# EAGLE design AeroQuad_v18 (EAGLE 5.10)
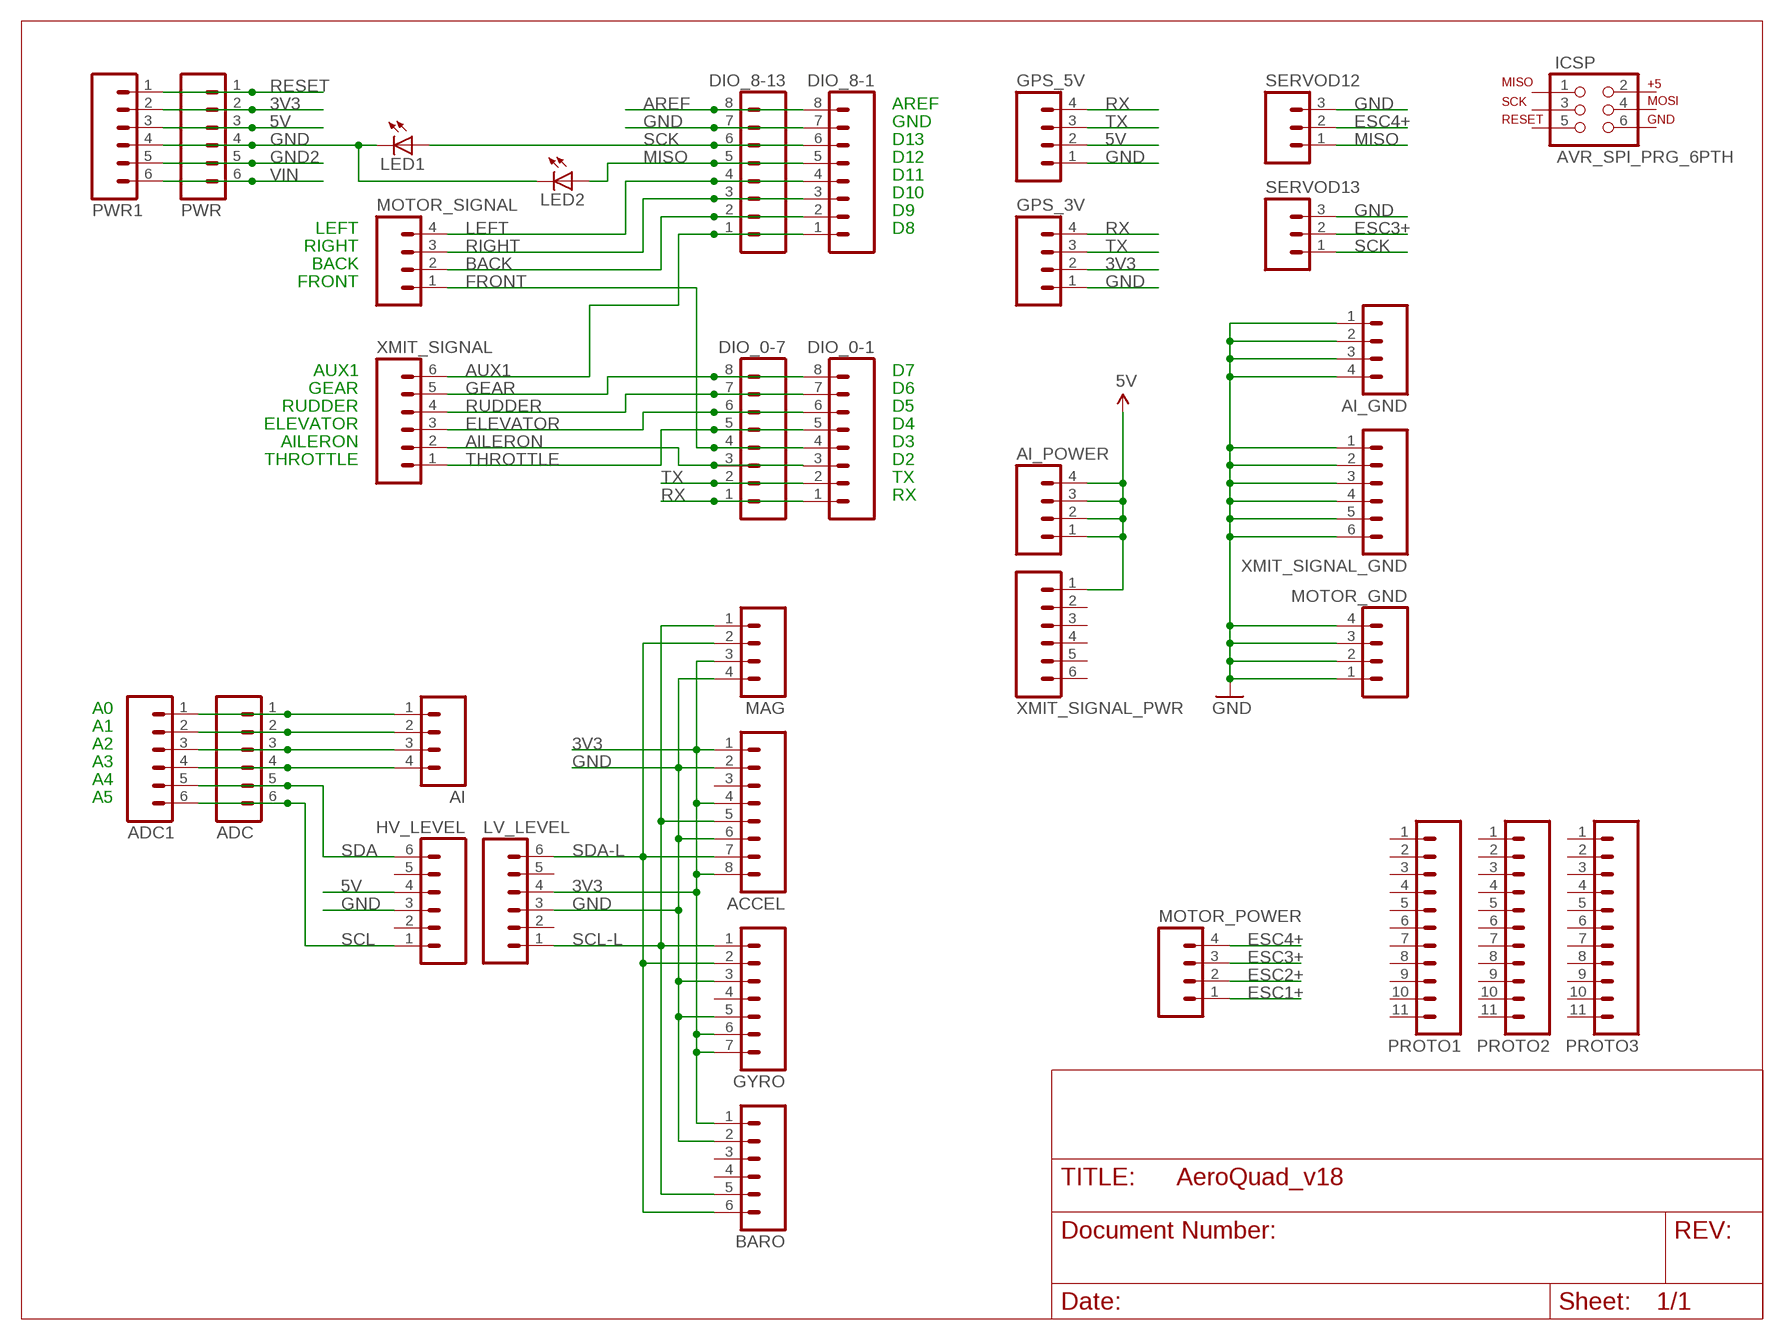
[diagram p0: schematic, sheet 1]

## Parts
ACCEL  M08LOCK  [1X08_LOCK]
ADC  M06LOCK  [1X06_LOCK]
ADC1  M06LOCK  [1X06_LOCK]
AI  M04LOCK  [1X04_LOCK]
AI_GND  M04LOCK  [1X04_LOCK]
AI_POWER  M04LOCK  [1X04_LOCK]
BARO  M06LOCK  [1X06_LOCK]
DIO_0-1  M08LOCK  [1X08_LOCK]
DIO_0-7  M08LOCK  [1X08_LOCK]
DIO_8-1  M08LOCK  [1X08_LOCK]
DIO_8-13  M08LOCK  [1X08_LOCK]
GPS_3V  M04LOCK  [1X04_LOCK]
GPS_5V  M04LOCK  [1X04_LOCK]
GYRO  M07LOCK  [1X07_LOCK]
HV_LEVEL  M06LOCK  [1X06_LOCK]
ICSP  AVR_SPI_PRG_6PTH  [2X3]
LED1  LED5MM  [LED5MM]
LED2  LED5MM  [LED5MM]
LV_LEVEL  M06LOCK  [1X06_LOCK]
MAG  M04LOCK  [1X04_LOCK]
MOTOR_GND  M04LOCK  [1X04_LOCK]
MOTOR_POWER  M04LOCK  [1X04_LOCK]
MOTOR_SIGNAL  M04LOCK  [1X04_LOCK]
PROTO1  M11PTH  [1X11]
PROTO2  M11PTH  [1X11]
PROTO3  M11PTH  [1X11]
PWR  M06LOCK  [1X06_LOCK]
PWR1  M06LOCK  [1X06_LOCK]
SERVOD12  M03LOCK  [1X03_LOCK]
SERVOD13  M03LOCK  [1X03_LOCK]
XMIT_SIGNAL  M06LOCK  [1X06_LOCK]
XMIT_SIGNAL_GND  M06LOCK  [1X06_LOCK]
XMIT_SIGNAL_PWR  M06LOCK  [1X06_LOCK]

## Nets
3V3: ACCEL.1 ACCEL.4 ACCEL.8 BARO.1 GPS_3V.2 GYRO.6 GYRO.7 LV_LEVEL.4 MAG.3 PWR1.2 PWR.2
5V: AI_POWER.1 AI_POWER.2 AI_POWER.3 AI_POWER.4 GPS_5V.2 HV_LEVEL.4 PWR1.3 PWR.3 XMIT_SIGNAL_PWR.1
AILERON: DIO_0-1.3 DIO_0-7.3 XMIT_SIGNAL.2
AREF: DIO_8-1.8 DIO_8-13.8
AUX1: DIO_8-1.1 DIO_8-13.1 XMIT_SIGNAL.6
BACK: DIO_8-1.2 DIO_8-13.2 MOTOR_SIGNAL.2
ELEVATOR: DIO_0-1.6 DIO_0-7.6 XMIT_SIGNAL.3
ESC1+: MOTOR_POWER.1
ESC2+: MOTOR_POWER.2
ESC3+: MOTOR_POWER.3 SERVOD13.2
ESC4+: MOTOR_POWER.4 SERVOD12.2
FRONT: DIO_0-1.4 DIO_0-7.4 MOTOR_SIGNAL.1
GEAR: DIO_0-1.8 DIO_0-7.8 XMIT_SIGNAL.5
GND: ACCEL.2 ACCEL.6 AI_GND.1 AI_GND.2 AI_GND.3 AI_GND.4 BARO.2 DIO_8-1.7 DIO_8-13.7 GPS_3V.1 GPS_5V.1 GYRO.3 GYRO.5 HV_LEVEL.3 LED1.K(C) LED2.K(C) LV_LEVEL.3 MAG.4 MOTOR_GND.1 MOTOR_GND.2 MOTOR_GND.3 MOTOR_GND.4 PWR1.4 PWR.4 SERVOD12.3 SERVOD13.3 XMIT_SIGNAL_GND.1 XMIT_SIGNAL_GND.2 XMIT_SIGNAL_GND.3 XMIT_SIGNAL_GND.4 XMIT_SIGNAL_GND.5 XMIT_SIGNAL_GND.6
GND2: PWR1.5 PWR.5
LEFT: DIO_8-1.4 DIO_8-13.4 MOTOR_SIGNAL.4
MISO: DIO_8-1.5 DIO_8-13.5 LED2.A SERVOD12.1
N$2: ADC1.1 ADC.1 AI.1
N$3: ADC1.2 ADC.2 AI.2
N$4: ADC1.3 ADC.3 AI.3
N$5: ADC1.4 ADC.4 AI.4
RESET: PWR1.1 PWR.1
RIGHT: DIO_8-1.3 DIO_8-13.3 MOTOR_SIGNAL.3
RUDDER: DIO_0-1.7 DIO_0-7.7 XMIT_SIGNAL.4
RX: DIO_0-1.1 DIO_0-7.1 GPS_3V.4 GPS_5V.4
SCK: DIO_8-1.6 DIO_8-13.6 LED1.A SERVOD13.1
SCL: ADC1.6 ADC.6 HV_LEVEL.1
SCL-L: ACCEL.5 BARO.5 GYRO.1 LV_LEVEL.1 MAG.1
SDA: ADC1.5 ADC.5 HV_LEVEL.6
SDA-L: ACCEL.7 BARO.6 GYRO.2 LV_LEVEL.6 MAG.2
THROTTLE: DIO_0-1.5 DIO_0-7.5 XMIT_SIGNAL.1
TX: DIO_0-1.2 DIO_0-7.2 GPS_3V.3 GPS_5V.3
VIN: PWR1.6 PWR.6
Unconnected: ACCEL.3 BARO.3 BARO.4 GYRO.4 HV_LEVEL.2 HV_LEVEL.5 ICSP.1 ICSP.2 ICSP.3 ICSP.4 ICSP.5 ICSP.6 LV_LEVEL.2 LV_LEVEL.5 PROTO1.1 PROTO1.2 PROTO1.3 PROTO1.4 PROTO1.5 PROTO1.6 PROTO1.7 PROTO1.8 PROTO1.9 PROTO1.10 PROTO1.11 PROTO2.1 PROTO2.2 PROTO2.3 PROTO2.4 PROTO2.5 PROTO2.6 PROTO2.7 PROTO2.8 PROTO2.9 PROTO2.10 PROTO2.11 PROTO3.1 PROTO3.2 PROTO3.3 PROTO3.4 PROTO3.5 PROTO3.6 PROTO3.7 PROTO3.8 PROTO3.9 PROTO3.10 PROTO3.11 XMIT_SIGNAL_PWR.2 XMIT_SIGNAL_PWR.3 XMIT_SIGNAL_PWR.4 XMIT_SIGNAL_PWR.5 XMIT_SIGNAL_PWR.6

## Notes on the sheet
- AREF
- GND
- D13
- D12
- D11
- D10
- D9
- LEFT | D8
- RIGHT
- BACK
- FRONT
- AUX1 | D7
- GEAR | D6
- RUDDER | D5
- ELEVATOR | D4
- AILERON | D3
- THROTTLE | D2
- TX
- RX
- A0
- A1
- A2
- A3
- A4
- A5

## Library data of the parts
ACCEL DIO_0-1 DIO_0-7 DIO_8-1 DIO_8-13 = SparkFun:M08: Header 8 Standard 8-pin 0.1" header. Use with straight break away headers (SKU : PRT-00116), right angle break away headers (PRT-00553), swiss pins (PRT-00743), machine pins (PRT-00117), and female headers (PRT-00115).
ADC ADC1 BARO HV_LEVEL LV_LEVEL PWR PWR1 XMIT_SIGNAL XMIT_SIGNAL_GND XMIT_SIGNAL_PWR = SparkFun:M06: Header 6 Standard 6-pin 0.1" header. Use with straight break away headers (SKU : PRT-00116), right angle break away headers (PRT-00553), swiss pins (PRT-00743), machine pins (PRT-00117), and female headers (PRT-00115). Molex polarized connector foot print use with SKU : PRT-08094 with associated crimp pins and housings. NOTES ON THE VARIANTS LOCK and LOCK_LONGPADS... This footprint was designed to help hold the alignment of a through-hole component (i.e. 6-pin header) while soldering it into place. You may notice that each hole has been shifted either up or down by 0.005 of an inch from it's more standard position (which is a perfectly straight line). This slight alteration caused the pins (the squares in the middle) to touch the edges of the holes. Because they are alternating, it causes a "brace" to hold the component in place. 0.005 has proven to be the perfect amount of "off-center" position when using our standard breakaway headers. Although looks a little odd when you look at the bare footprint, once you have a header in there, the alteration is very hard to notice. Also, if you push a header all the way into place, it is covered up entirely on the bottom side. This idea of altering the position of holes to aid alignment will be further integrated into the Sparkfun Library for other footprints. It can help hold any component with 3 or more connection pins.
AI AI_GND AI_POWER GPS_3V GPS_5V MAG MOTOR_GND MOTOR_POWER MOTOR_SIGNAL = SparkFun:M04: Header 4 Standard 4-pin 0.1" header. Use with straight break away headers (SKU : PRT-00116), right angle break away headers (PRT-00553), swiss pins (PRT-00743), machine pins (PRT-00117), and female headers (PRT-00115). Molex polarized connector foot print use with SKU : PRT-08231 with associated crimp pins and housings.
GYRO = SparkFun:M07: Header 7 Standard 7-pin 0.1" header. Use with straight break away headers (SKU : PRT-00116), right angle break away headers (PRT-00553), swiss pins (PRT-00743), machine pins (PRT-00117), and female headers (PRT-00115). NOTES ON THE VARIANTS LOCK and LOCK_LONGPADS... This footprint was designed to help hold the alignment of a through-hole component (i.e. 7-pin header) while soldering it into place. You may notice that each hole has been shifted either up or down by 0.005 of an inch from it's more standard position (which is usually a perfectly straight line). This slight alteration caused the pins (the squares in the middle) to touch the edges of the holes. Because they are alternating, it causes a "brace" to hold the header in place. 0.005 has proven to be the perfect amount of "off-center" position when using our standard breakaway headers. Although looks a little odd when you look at the bare footprint, once you have a header in there, the alteration is very hard to notice. Also, if you push a header all the way into place, it is covered up entirely on the bottom side. This idea of altering the position of holes to aid alignment will be further integrated into the Sparkfun Library for other footprints. It can help hold any component with 3 or more connection pins.
ICSP = SparkFun:AVR_SPI_PRG_6: AVR ISP 6 Pin This is the reduced ISP connector for AVR programming. Common on Arduino. This footprint will take up less PCB space and can be used with a 10-pin to 6-pin adapter such as SKU: BOB-08508
LED1 LED2 = SparkFun:LED: LEDs Standard schematic elements and footprints for 5mm, 3mm, 1206, and 0603 sized LEDs. 5mm - Spark Fun Electronics SKU : COM-00529 (and others)
PROTO1-PROTO3 = SparkFun:M11: Header 11 Standard 11-pin 0.1" header. Use with straight break away headers (SKU : PRT-00116), right angle break away headers (PRT-00553), swiss pins (PRT-00743), machine pins (PRT-00117), and female headers (PRT-00115).
SERVOD12 SERVOD13 = SparkFun:M03: Header 3 Standard 3-pin 0.1" header. Use with straight break away headers (SKU : PRT-00116), right angle break away headers (PRT-00553), swiss pins (PRT-00743), machine pins (PRT-00117), and female headers (PRT-00115). Molex polarized connector foot print use with SKU : PRT-08232 with associated crimp pins and housings.

## Board
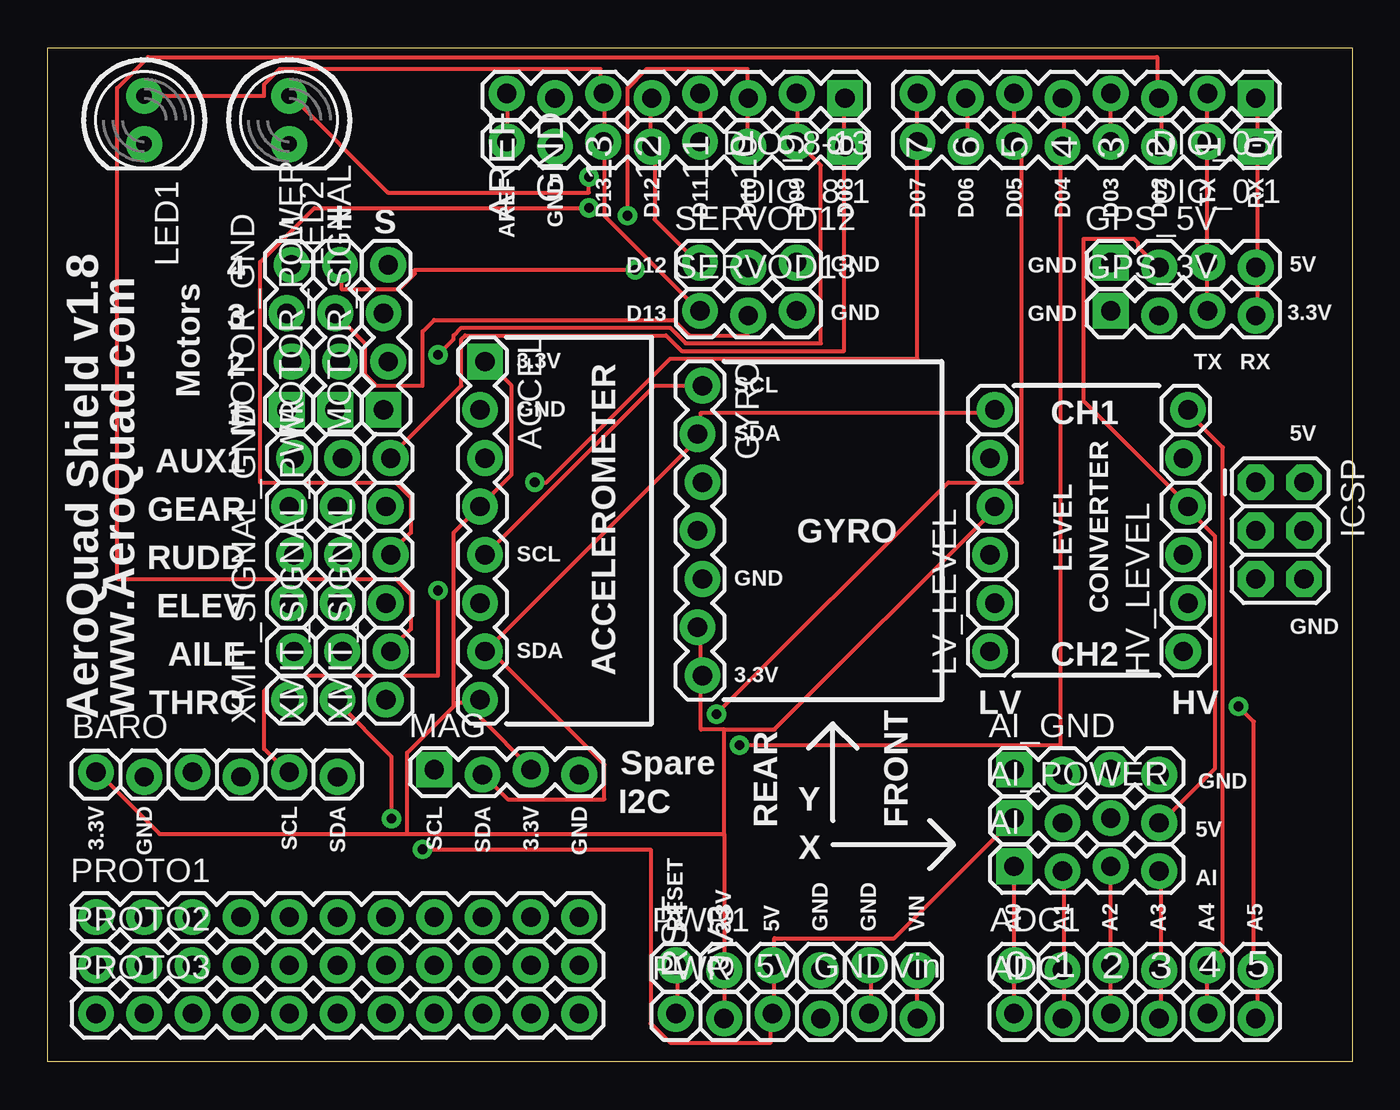
[diagram p1: board, top side]
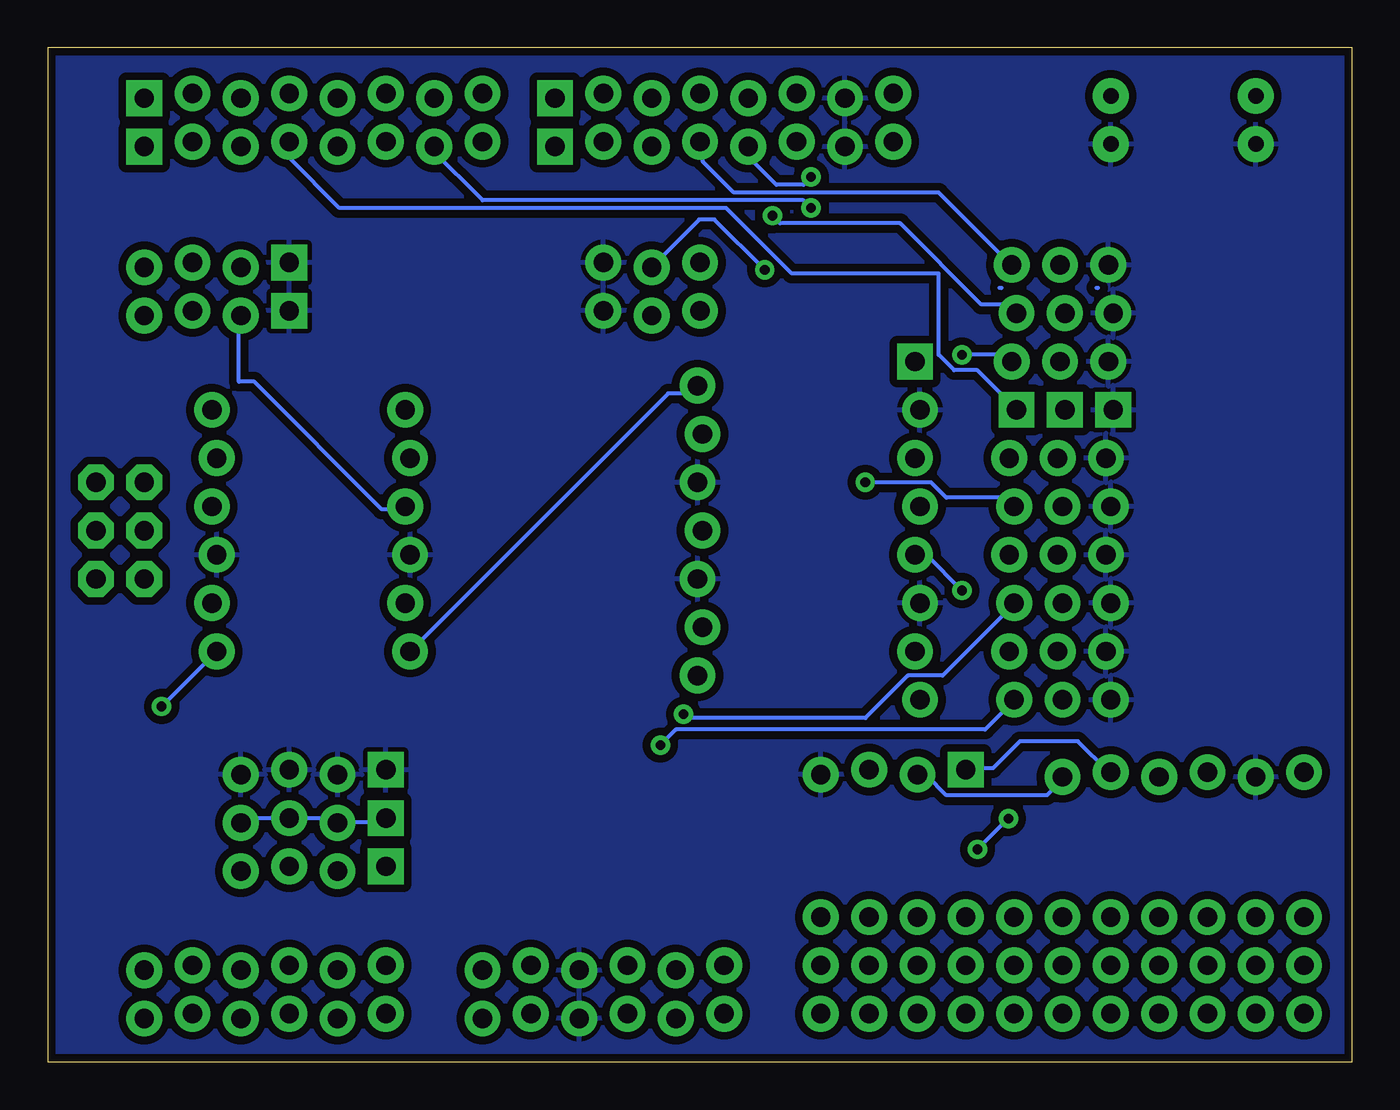
[diagram p2: board, bottom side, seen from below]

Size 68.58 x 53.34 mm. Coordinates in mm from the lower left corner, seen from the top.
Outline: 0,53.34 68.58,53.34 68.58,0 0,0 0,53.34
Copper layers (1*16): Top 0.035mm / dielectric 1.5mm / Bottom 0.035mm
Design rules "SparkFun": minimum track width 8mil, minimum drill 20mil, track to track 8mil, track to pad 8mil, pad to pad 8mil, via to via 8mil, smd to smd 8mil, copper to edge 10mil, drill to drill 8mil, minimum pad ring 12mil, minimum via ring 10mil, stop-mask expansion 4mil, vias tented up to drill 25mil, thermal gap 10mil

### Footprints (pad centres in the part's own frame; a part is rotated, then mirrored left to right if it is on the bottom)
1X08_LOCK = drill 1.016 pad 1.88 square: 1 0,0.127 | drill 1.016 pad 1.88 round: 2 2.54,-0.127; 3 5.08,0.127; 4 7.62,-0.127; 5 10.16,0.127; 6 12.7,-0.127; 7 15.24,0.127; 8 17.78,-0.127
1X06_LOCK = drill 1.016 pad 1.88 round: 1 0,0; 2 2.54,-0.254; 3 5.08,0; 4 7.62,-0.254; 5 10.16,0; 6 12.7,-0.254
1X04_LOCK = drill 1.016 pad 1.88 square: 1 0,0.127 | drill 1.016 pad 1.88 round: 2 2.54,-0.127; 3 5.08,0.127; 4 7.62,-0.127
1X07_LOCK = drill 1.016 pad 1.88 round: 1 0,0.127; 2 2.54,-0.127; 3 5.08,0.127; 4 7.62,-0.127; 5 10.16,0.127; 6 12.7,-0.127; 7 15.24,0.127
2X3 = drill 1.016 pad 1.88 octagon: 1 0,0; 2 0,2.54; 3 2.54,0; 4 2.54,2.54; 5 5.08,0; 6 5.08,2.54
LED5MM = drill 0.813 pad 1.88 round: A -1.27,0; K 1.27,0
1X11 = drill 1.016 pad 1.88 round: 1 0,0; 2 2.54,0; 3 5.08,0; 4 7.62,0; 5 10.16,0; 6 12.7,0; 7 15.24,0; 8 17.78,0; 9 20.32,0; 10 22.86,0; 11 25.4,0
1X03_LOCK = drill 1.016 pad 1.88 round: 1 0,0.127; 2 2.54,-0.127; 3 5.08,0.127

### Placement (x,y rotation side)
ACCEL  22.86,36.83 270 top
ADC  50.8,2.54 0 top
ADC1  50.8,5.08 0 top
AI  50.8,10.16 0 top
AI_GND  50.8,15.24 0 top
AI_POWER  50.8,12.7 0 top
BARO  2.54,15.24 0 top
DIO_0-1  63.5,48.26 180 top
DIO_0-7  63.5,50.8 180 top
DIO_8-1  41.91,48.26 180 top
DIO_8-13  41.91,50.8 180 top
GPS_3V  55.88,39.37 0 top
GPS_5V  55.88,41.91 0 top
GYRO  34.29,35.56 270 top
HV_LEVEL  59.69,21.59 90 top
ICSP  63.5,30.48 270 top
LED1  5.08,49.53 270 top
LED2  12.7,49.53 270 top
LV_LEVEL  49.53,21.59 90 top
MAG  20.32,15.24 0 top
MOTOR_GND  12.7,34.29 90 top
MOTOR_POWER  15.24,34.29 90 top
MOTOR_SIGNAL  17.78,34.29 90 top
PROTO1  2.54,7.62 0 top
PROTO2  2.54,5.08 0 top
PROTO3  2.54,2.54 0 top
PWR  33.02,2.54 0 top
PWR1  33.02,5.08 0 top
SERVOD12  34.29,41.91 0 top
SERVOD13  34.29,39.37 0 top
XMIT_SIGNAL  17.78,19.05 90 top
XMIT_SIGNAL_GND  12.7,19.05 90 top
XMIT_SIGNAL_PWR  15.24,19.05 90 top

### Tracks (layer width: path | path; a pad name or v marks a point on that pad's centre or on a via)
3V3
  Top 0.203: 18.9,11.99 5.89,11.99 2.64,15.24 BARO.1 | 18.9,11.99 18.9,16.26 21.34,18.69 | 21.34,18.69 21.54,18.9 22.55,18.9 ACCEL.8 22.76,18.9 22.76,18.09 25.4,15.44 MAG.3 | 21.34,18.69 21.34,27.84 22.55,29.06 ACCEL.4 22.76,29.26 24.38,30.89 24.38,35.56 23.16,36.78 ACCEL.1 | PWR.2 PWR1.2 35.56,11.99 | 34.34,20.32 34.34,22.76 GYRO.6 | 35.56,17.48 34.34,17.48 34.34,20.32 | 35.56,17.48 38.2,17.48 49.78,29.06 LV_LEVEL.4 | 34.34,20.32 GYRO.7 | 35.56,11.99 35.56,17.48 | 18.9,11.99 35.56,11.99
  Bottom 0.203: GPS_3V.2 58.52,39.22 58.52,35.76 57.71,35.76 51,29.06 49.78,29.06 LV_LEVEL.4
5V  (via drill 0.51)
  Top 0.203: AI_POWER.4 58.52,12.6 61.37,15.44 61.37,27.64 59.94,29.06 HV_LEVEL.4 59.94,29.26 54.46,34.75 54.46,43.28 57.1,43.28 57.3,43.08 57.3,42.88 58.32,41.86 GPS_5V.2 | v18.09,12.8 18.09,16.05 15.24,18.9 XMIT_SIGNAL_PWR.1 | v19.71,11.18 31.7,11.18 31.7,2.03 32.72,1.02 38,1.02 38,2.44 PWR.3 38.2,2.64 38.2,5.08 | 38.2,5.08 38.2,6.5 44.5,6.5 50.8,12.8 AI_POWER.1 | 38.2,5.08 PWR1.3
  Bottom 0.203: 55.88,12.8 53.65,12.8 53.44,12.6 AI_POWER.2 53.24,12.6 51,12.6 50.8,12.8 AI_POWER.1 | 55.88,12.8 58.12,12.8 58.32,12.6 AI_POWER.4 | 55.88,12.8 AI_POWER.3 | v19.71,11.18 v18.09,12.8
AILERON
  Top 0.203: XMIT_SIGNAL.2 18.09,21.74 19.1,22.76 19.1,24.59 18.29,25.4 3.66,25.4 3.66,51.21 5.28,52.83 58.32,52.83 58.32,50.8 DIO_0-7.3 58.52,50.6 58.52,48.16 DIO_0-1.3
AREF
  Top 0.203: DIO_8-1.8 24.18,48.56 24.18,50.8 DIO_8-13.8
AUX1
  Top 0.203: XMIT_SIGNAL.6 18.09,31.9 21.74,35.56 21.74,38 21.95,38.2 32.51,38.2 33.33,37.39 41.86,37.39 41.86,47.95 DIO_8-1.1 41.86,48.16 41.86,50.6 DIO_8-13.1
BACK  (via drill 0.51)
  Top 0.203: v20.52,37.19 21.34,38 21.34,38.2 21.74,38.61 32.72,38.61 33.53,37.8 40.64,37.8 40.64,47.14 39.42,48.36 DIO_8-1.2 39.42,48.56 39.42,50.8 DIO_8-13.2
  Bottom 0.203: v20.52,37.19 18.29,37.19 18.09,36.98 MOTOR_SIGNAL.2
ELEVATOR  (via drill 0.51)
  Top 0.203: v35.15,18.29 47.35,30.48 51.21,30.48 51.21,47.95 50.8,48.36 DIO_0-1.6 DIO_0-7.6
  Bottom 0.203: v35.15,18.29 34.95,18.09 25.6,18.09 23.37,20.32 21.54,20.32 17.88,23.98 XMIT_SIGNAL.3
ESC3+
  Top 0.203: MOTOR_POWER.3 15.24,39.22 16.66,37.8 16.66,36.17 17.27,35.56 19.71,35.56 19.71,38.41 20.32,39.01 32.92,39.01 33.73,38.2 36.78,38.2 36.78,39.22 SERVOD13.2
ESC4+  (via drill 0.51)
  Top 0.203: v30.89,41.66 19.3,41.66 19.3,41.45 18.49,40.64 15.44,40.64 15.44,41.86 MOTOR_POWER.4
  Bottom 0.203: v30.89,41.66 33.53,44.3 34.34,44.3 36.78,41.86 SERVOD12.2
FRONT
  Top 0.203: DIO_0-1.4 DIO_0-7.4
  Bottom 0.203: MOTOR_SIGNAL.1 17.68,34.34 19.71,36.37 20.93,36.37 21.74,37.19 21.74,41.45 29.46,41.45 32.92,44.91 53.24,44.91 55.88,47.55 DIO_0-1.4
GEAR  (via drill 0.51)
  Top 0.203: v25.6,30.48 26.21,30.48 32.72,36.98 45.72,36.98 DIO_0-1.8 DIO_0-7.8
  Bottom 0.203: v25.6,30.48 22.15,30.48 21.34,29.67 18.29,29.67 17.88,29.26 XMIT_SIGNAL.5
GND
  pour Bottom (isolate 0.406): 0,53.34 68.58,53.34 68.58,0 0,0
GND2
  Top 0.203: PWR.5 43.28,2.64 43.28,5.08 PWR1.5
LEFT
  Top 0.203: DIO_8-13.4 34.34,50.8 34.34,48.56 DIO_8-1.4
  Bottom 0.203: MOTOR_SIGNAL.4 18.09,42.06 21.74,45.72 32.51,45.72 34.14,47.35 34.14,48.36 DIO_8-1.4
MISO  (via drill 0.51)
  Top 0.203: DIO_8-13.5 31.7,50.6 31.7,48.16 DIO_8-1.5 31.9,47.95 31.9,44.3 34.14,42.06 SERVOD12.1 | v28.45,46.53 28.45,45.72 17.88,45.72 12.8,50.8 LED2.A
  Bottom 0.203: v28.45,46.53 28.85,46.13 30.28,46.13 31.7,47.55 31.7,47.95 DIO_8-1.5
N$2
  Top 0.203: ADC.1 ADC1.1 AI.1
N$3
  Top 0.203: ADC.2 53.44,2.44 53.44,4.67 ADC1.2 53.44,4.88 53.44,9.96 AI.2
N$4
  Top 0.203: ADC.3 ADC1.3 AI.3
N$5
  Top 0.203: ADC.4 58.52,2.44 58.52,4.67 ADC1.4 58.52,4.88 58.52,9.96 AI.4
N$7
  Bottom 0.203: 18.54,40.72 18.44,40.69
N$10
  Bottom 0.203: 13.46,40.72 13.36,40.69
RESET
  Top 0.203: PWR.1 33.12,2.64 33.12,5.08 PWR1.1
RIGHT  (via drill 0.51)
  Top 0.203: v30.48,44.5 30.48,51.21 31.5,52.22 36.78,52.22 36.78,50.8 DIO_8-13.3 36.78,50.6 36.78,48.16 DIO_8-1.3
  Bottom 0.203: v30.48,44.5 30.07,44.09 23.77,44.09 19.51,39.83 18.09,39.83 17.68,39.42 MOTOR_SIGNAL.3
RUDDER  (via drill 0.51)
  Top 0.203: v28.45,44.91 14.02,44.91 11.18,42.06 11.18,30.48 18.29,30.48 19.1,29.67 19.1,27.84 18.09,26.82 XMIT_SIGNAL.4 | DIO_0-7.7 48.36,50.6 48.36,48.16 DIO_0-1.7
  Bottom 0.203: v28.45,44.91 28.85,45.31 45.72,45.31 48.36,47.95 DIO_0-1.7
RX
  Top 0.203: GPS_3V.4 63.6,39.42 63.6,41.66 GPS_5V.4 63.6,41.86 63.6,47.95 DIO_0-1.1 63.6,48.16 63.6,50.6 DIO_0-7.1
SCK
  Top 0.203: LED1.A 11.38,50.8 11.38,51.41 12.19,52.22 29.06,52.22 29.06,51 DIO_8-13.6 29.26,50.8 29.26,48.56 DIO_8-1.6 29.26,48.36 29.26,44.5 34.14,39.62 SERVOD13.1
SCL  (via drill 0.51)
  Top 0.203: ADC.6 63.6,2.44 63.6,4.67 ADC1.6 63.4,4.88 63.4,17.88 v62.59,18.69
  Bottom 0.203: v62.59,18.69 HV_LEVEL.1
SCL-L  (via drill 0.51)
  Top 0.203: ACCEL.5 23.16,26.82 31.9,35.56 GYRO.1 | v20.52,24.79 20.52,20.32 12.19,20.32 11.38,19.51 11.38,16.46 12.6,15.24 BARO.5
  Bottom 0.203: BARO.5 12.8,15.24 14.43,16.87 17.48,16.87 18.9,15.44 20.32,15.44 MAG.1 | LV_LEVEL.1 35.97,35.15 34.95,35.15 34.54,35.56 GYRO.1 | v20.52,24.79 22.35,26.62 22.96,26.62 ACCEL.5
SDA
  Top 0.203: ADC.5 ADC1.5 61.77,5.89 61.77,32.31 59.94,34.14 HV_LEVEL.6
SDA-L
  Top 0.203: 23.16,21.74 34.14,32.72 34.14,32.92 GYRO.2 34.34,33.12 34.34,34.14 49.78,34.14 LV_LEVEL.6 | 23.16,21.74 29.26,15.65 29.26,13.82 24.18,13.82 22.96,15.04 MAG.2 | 23.16,21.74 ACCEL.7
  Bottom 0.203: BARO.6 15.24,14.83 16.05,14.02 21.34,14.02 22.35,15.04 22.76,15.04 MAG.2
THROTTLE  (via drill 0.51)
  Top 0.203: v36.37,16.66 53.24,16.66 53.24,47.95 DIO_0-1.5 53.44,48.16 53.44,50.6 DIO_0-7.5
  Bottom 0.203: v36.37,16.66 35.56,17.48 19.3,17.48 17.88,18.9 XMIT_SIGNAL.1
TX
  Top 0.203: GPS_3V.3 GPS_5V.3 DIO_0-1.2 DIO_0-7.2
VIN
  Top 0.203: PWR.6 PWR1.6

### Text on the board
tPlace: AREF | GND | D13 | D12 | D11 | D10 | D09 | D08 | D07 | D06 | D05 | D04 | D03 | D02 | TX | RX | - | + | S | 4 | D12 | GND | GND | 5V | 3 | D13 | GND | GND | 3.3V | 2 | TX | RX | 3.3V | Motors | 1 | SCL | GND | CH1 | SDA | 5V | AUX1 | GEAR | RUDD | GYRO | SCL | LEVEL | ELEV | GND | CONVERTER | AILE | GND | SDA | CH2 | THRO | ACCELEROMETER | 3.3V | AeroQuad Shield v1.8 | www.AeroQuad.com | LV | HV | Spare | Y | GND | 3.3V | GND | SCL | SDA | SCL | SDA | 3.3V | GND | I2C | REAR | X | FRONT | 5V | AI | RESET | 3.3V | 5V | GND | GND | VIN | A0 | A1 | A2 | A3 | A4 | A5
tNames: 9 | 8 | 7 | 6 | 5 | 4 | 3 | 2 | 1 | 0 | 13 | 12 | 11 | 10 | GND | AREF | RST | 3V3 | 5V | GND | Vin | 0 | 1 | 2 | 3 | 4 | 5